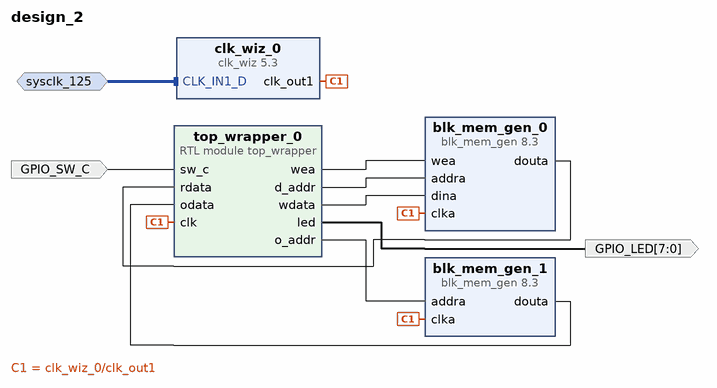
[diagram p0: block diagram of the top level]
# Vivado block design design_2, xcku040-ffva1156-2-e, Vivado 2016.4
create_bd_design design_2

create_bd_intf_port -mode Slave -vlnv xilinx.com:interface:diff_clock_rtl:1.0 sysclk_125
set_property -dict {CONFIG.FREQ_HZ 125000000} [get_bd_intf_ports sysclk_125]
create_bd_port -dir O -from 7 -to 0 -type data GPIO_LED
create_bd_port -dir I -type data GPIO_SW_C

create_bd_cell -type ip -vlnv xilinx.com:ip:blk_mem_gen:8.3 blk_mem_gen_0
set_property -dict [list \
  CONFIG.Enable_32bit_Address false \
  CONFIG.Use_Byte_Write_Enable false \
  CONFIG.Enable_A Always_Enabled \
  CONFIG.Register_PortA_Output_of_Memory_Primitives false \
  CONFIG.Register_PortA_Output_of_Memory_Core false \
  CONFIG.Use_RSTA_Pin false \
  CONFIG.use_bram_block Stand_Alone \
] [get_bd_cells blk_mem_gen_0]
create_bd_cell -type ip -vlnv xilinx.com:ip:blk_mem_gen:8.3 blk_mem_gen_1
set_property -dict [list \
  CONFIG.Enable_32bit_Address false \
  CONFIG.Use_Byte_Write_Enable false \
  CONFIG.Enable_A Always_Enabled \
  CONFIG.Register_PortA_Output_of_Memory_Primitives false \
  CONFIG.Load_Init_File true \
  CONFIG.Coe_File ../../../../../../../example.coe \
  CONFIG.Use_RSTA_Pin false \
  CONFIG.use_bram_block Stand_Alone \
] [get_bd_cells blk_mem_gen_1]
create_bd_cell -type ip -vlnv xilinx.com:ip:clk_wiz:5.3 clk_wiz_0
set_property -dict {CONFIG.USE_BOARD_FLOW true CONFIG.CLK_IN1_BOARD_INTERFACE sysclk_125} [get_bd_cells clk_wiz_0]
create_bd_cell -type module -reference top_wrapper top_wrapper_0

# ---- connections ----

connect_bd_intf_net -intf_net sysclk_125_1 [get_bd_intf_ports sysclk_125] [get_bd_intf_pins clk_wiz_0/CLK_IN1_D]
connect_bd_net [get_bd_pins top_wrapper_0/o_addr] [get_bd_pins blk_mem_gen_1/addra]
connect_bd_net [get_bd_pins top_wrapper_0/wea] [get_bd_pins blk_mem_gen_0/wea]
connect_bd_net [get_bd_pins blk_mem_gen_0/douta] [get_bd_pins top_wrapper_0/rdata]
connect_bd_net [get_bd_pins top_wrapper_0/d_addr] [get_bd_pins blk_mem_gen_0/addra]
connect_bd_net [get_bd_pins top_wrapper_0/wdata] [get_bd_pins blk_mem_gen_0/dina]
connect_bd_net [get_bd_pins blk_mem_gen_1/douta] [get_bd_pins top_wrapper_0/odata]
connect_bd_net [get_bd_pins top_wrapper_0/led] [get_bd_ports GPIO_LED]
connect_bd_net [get_bd_pins clk_wiz_0/clk_out1] [get_bd_pins blk_mem_gen_0/clka] [get_bd_pins blk_mem_gen_1/clka] [get_bd_pins top_wrapper_0/clk]
connect_bd_net [get_bd_ports GPIO_SW_C] [get_bd_pins top_wrapper_0/sw_c]

validate_bd_design
save_bd_design
